# EAGLE schematic megaUSB_spider (EAGLE 6.5.0)
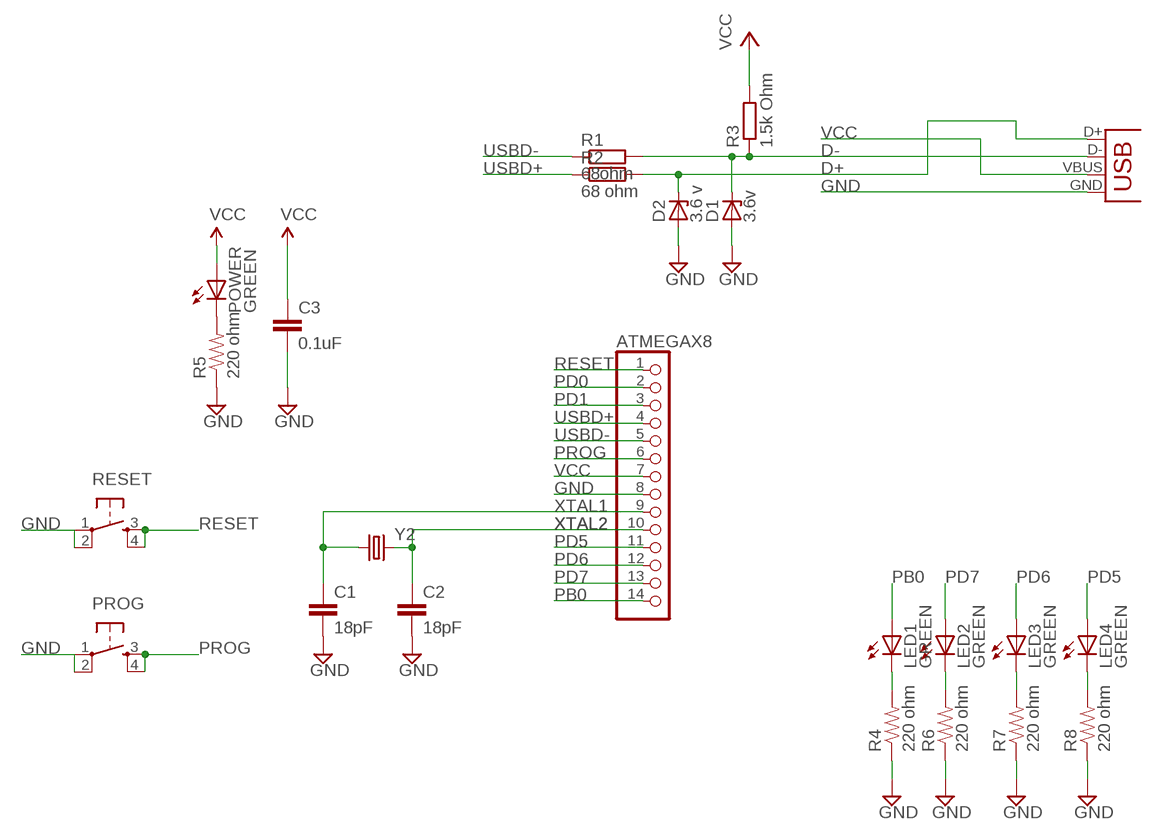
[diagram p0: schematic, sheet 1]

## Parts
ATMEGAX8  PINHD-1X14  [1X14]
C1  18pF  CAP1206  [1206]
C2  18pF  CAP1206  [1206]
C3  0.1uF  CAP1206  [1206]
D1  3.6v  ZENER-DIODESOT23  [SOT23]
D2  3.6 v  ZENER-DIODESOT23  [SOT23]
JP1  USBSMD  [USB-MINIB]
LED1  GREEN  LED-GREENLARGE  [LED-1206]
LED2  GREEN  LED-GREENLARGE  [LED-1206]
LED3  GREEN  LED-GREENLARGE  [LED-1206]
LED4  GREEN  LED-GREENLARGE  [LED-1206]
POWER  GREEN  LED-GREENLARGE  [LED-1206]
PROG  TAC_SWITCHPTH  [TACTILE-PTH]
R1  68ohm  R-EU_R0805  [R0805]
R2  68 ohm  R-EU_R0805  [R0805]
R3  1.5k Ohm  R-EU_R1206  [R1206]
R4  220 ohm  RESISTOR1206  [1206]
R5  220 ohm  RESISTOR1206  [1206]
R6  220 ohm  RESISTOR1206  [1206]
R7  220 ohm  RESISTOR1206  [1206]
R8  220 ohm  RESISTOR1206  [1206]
RESET  TAC_SWITCHPTH  [TACTILE-PTH]
Y2  CRYSTALHC49US  [HC49US]

## Nets
D+: D2.3(C) JP1.D+ R2.2
D-: D1.3(C) JP1.D- R1.2 R3.1
GND: ATMEGAX8.8 C1.2 C2.2 C3.2 D1.1(A) D2.1(A) JP1.GND PROG.1 PROG.2 R4.1 R5.1 R6.1 R7.1 R8.1 RESET.1 RESET.2
LED2: LED2.C R6.2
N$1: LED1.C R4.2
N$3: POWER.C R5.2
N$5: LED3.C R7.2
N$6: LED4.C R8.2
N$7: ATMEGAX8.14
PB0: LED1.A
PD0: ATMEGAX8.2
PD1: ATMEGAX8.3
PD5: ATMEGAX8.11 LED4.A
PD6: ATMEGAX8.12 LED3.A
PD7: ATMEGAX8.13 LED2.A
PROG: ATMEGAX8.6 PROG.3 PROG.4
RESET: ATMEGAX8.1 RESET.3 RESET.4
USBD+: ATMEGAX8.4 R2.1
USBD-: ATMEGAX8.5 R1.1
VCC: ATMEGAX8.7 C3.1 JP1.VBUS POWER.A R3.2
XTAL1: ATMEGAX8.9 C1.1 Y2.1
XTAL2: ATMEGAX8.10 C2.1 Y2.2

## Library data of the parts
ATMEGAX8 = pinhead:PINHD-1X14: PIN HEADER
C1-C3 = SparkFun-Capacitors:CAP: Capacitor Standard 0603 ceramic capacitor, and 0.1" leaded capacitor.
D1 D2 = diode:ZENER-DIODE: Z-Diode
JP1 = SparkFun-Connectors:USB: USB Connectors USB-B-PTH is fully proven SKU : PRT-00139/CONN-08278 USB-miniB is fully proven SKU : PRT-00587 USB-A-PCB is untested. USB-A-H is throughly reviewed, but untested. Spark Fun Electronics SKU : PRT-00437 USB-B-SMT is throughly reviewed, but untested. Needs silkscreen touching up. USB-A-S has not been used/tested USB-MB-H has not been used/tested USB-MICROB has been used. CONN-09505; PROD_ID: CONN-08193
LED1-LED4 POWER = SparkFun-LED:LED-GREEN: Various green LEDs 0603- DIO-00821 LARGE- DIO-00862 LILYPAD- DIO-09910; PROD_ID: DIO-00862
PROG RESET = SparkFun-Electromechanical:TAC_SWITCH: Momentary Switch Button commonly used for reset or general input. Spark Fun Electronics SKU : COM-00097 SMT- SWCH-08247
R1-R3 = resistor:R-EU_: RESISTOR, European symbol
R4-R8 = SparkFun-Passives:RESISTOR: Resistor Basic schematic elements and footprints for 0603, 1206, and PTH resistors.
Y2 = SparkFun-FreqCtrl:CRYSTAL: Various standard crystals. Proven footprints. Spark Fun Electronics SKU : COM-00534